# Altium schematic sheet main.SchDoc: =ProjectName+'_'+Revision+'_'+VariantName
size A3; Date: [Sheet Date]; Author: [Sheet Author]; Revision: 0; SheetNumber: 1; SheetTotal: 1
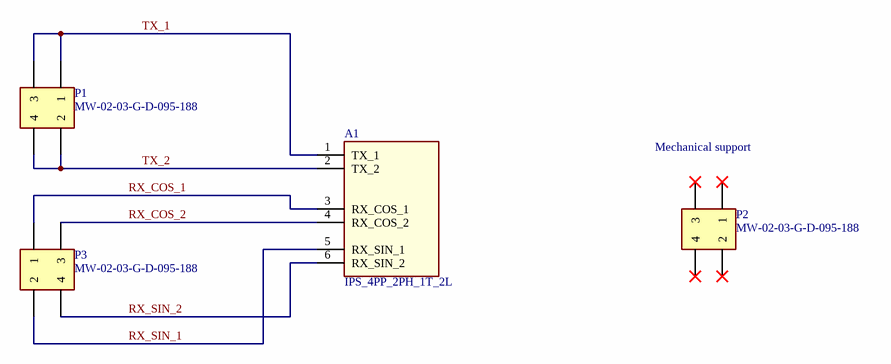
[diagram p0: main.SchDoc]

## Parts
A1  IPS_4PP_2PH_1T_2L  [IPS_4PP_2PH_1T_2L_6TX035_EXT]
P1  MW-02-03-G-D-095-188  [SAMTEC_MW-02-03-X-D-XXX-XXX]
P2  MW-02-03-G-D-095-188  [SAMTEC_MW-02-03-X-D-XXX-XXX]
P3  MW-02-03-G-D-095-188  [SAMTEC_MW-02-03-X-D-XXX-XXX]

## Nets
RX_COS_1: A1.3(RX_COS_1) P3.01(1)
RX_COS_2: A1.4(RX_COS_2) P3.03(3)
RX_SIN_1: A1.5(RX_SIN_1) P3.02(2)
RX_SIN_2: A1.6(RX_SIN_2) P3.04(4)
TX_1: A1.1(TX_1) P1.01(1) P1.03(3)
TX_2: A1.2(TX_2) P1.02(2) P1.04(4)

Not connected (* = marked no-connect by the designer): P2 01(1)* 02(2)* 03(3)* 04(4)*

## Notes on the sheet
- Mechanical support
- Proj
- Title:
- Approved:
- Sheet
- File Name:
- Rev:
- Author:
- Date:
- Size:
- A3
- Number:

## Library data of the parts
A1 = IPS_4PP_2PH_1T_2L_6TX035_EXT: Inductive position sensor, 2 phase, 1 turn, 2Layers 4 Pole pairs; MFG1: PMP; Int Diameter: 39.5mm; Ext Diameter: 63mm; MPN1: IPS_4PP_2PH_1T_2L_6TX035_EXT; Value: IPS_4PP_2PH_1T_2L
P1-P3 = MW-02-03-G-D-095-188: Samtech Male header 2x2,pitch 1mm; MP: TSW-108-07-G-S; MF: Samtec; ConnType: Board 2 Board; Min Op# Temp °C: -55; Max Op# temp °C: 125; System: Connector; Availability: Unavailable; Package: None; Value: MW-02-03-G-D-095-188; Price: None; MPN1: MW-02-03-G-D-095-188; MFG1: Samtec; Pins: 4; Pitch: 1mm; Orientation: Vertical; Mount: SMD; Supplier: Mouser; Supplier Part Number: 200-MW0203GD095188; Supplier URL: https://www.mouser.it/ProductDetail/Samtec/MW-02-03-G-D-095-188?qs=Jm2GQyTW%2FbjwYpCcfsw5tg%3D%3D; Datasheet URL: https://www.mouser.it/datasheet/3/85/1/mw_smt.pdf